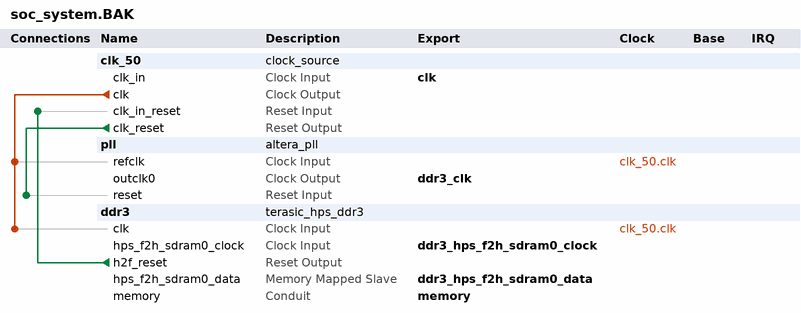
[diagram p0: system contents]
# Platform Designer (Qsys) system soc_system.BAK, Cyclone V 5CSEBA6U23I7
# Parameters at their usual value, and those the tool derives, are not listed.
package require -exact qsys 16.0
create_system soc_system.BAK
set_project_property DEVICE_FAMILY {Cyclone V}
set_project_property DEVICE 5CSEBA6U23I7

add_instance clk_50 clock_source 16.0
set_instance_parameter_value clk_50 clockFrequency 50000000

add_instance pll altera_pll 16.0
set_instance_parameter_value pll gui_device_speed_grade 1
set_instance_parameter_value pll gui_number_of_clocks 1
set_instance_parameter_value pll gui_operation_mode direct
set_instance_parameter_value pll gui_output_clock_frequency0 100.0
set_instance_parameter_value pll gui_pll_mode {Integer-N PLL}
set_instance_parameter_value pll gui_reference_clock_frequency 50.0
set_instance_parameter_value pll gui_use_locked false

add_instance ddr3 terasic_hps_ddr3 1.0

# connections
add_connection clk_50.clk ddr3.clk clock
add_connection clk_50.clk pll.refclk clock
add_connection clk_50.clk_reset pll.reset reset
add_connection ddr3.h2f_reset clk_50.clk_in_reset reset

# exported interfaces
add_interface clk clock sink
set_interface_property clk EXPORT_OF clk_50.clk_in
add_interface ddr3_clk clock source
set_interface_property ddr3_clk EXPORT_OF pll.outclk0
add_interface ddr3_hps_f2h_sdram0_clock clock sink
set_interface_property ddr3_hps_f2h_sdram0_clock EXPORT_OF ddr3.hps_f2h_sdram0_clock
add_interface ddr3_hps_f2h_sdram0_data avalon slave
set_interface_property ddr3_hps_f2h_sdram0_data EXPORT_OF ddr3.hps_f2h_sdram0_data
add_interface memory conduit end
set_interface_property memory EXPORT_OF ddr3.memory

set_interconnect_requirement {$system} qsys_mm.clockCrossingAdapter HANDSHAKE
set_interconnect_requirement {$system} qsys_mm.maxAdditionalLatency 1

save_system soc_system.BAK.qsys
